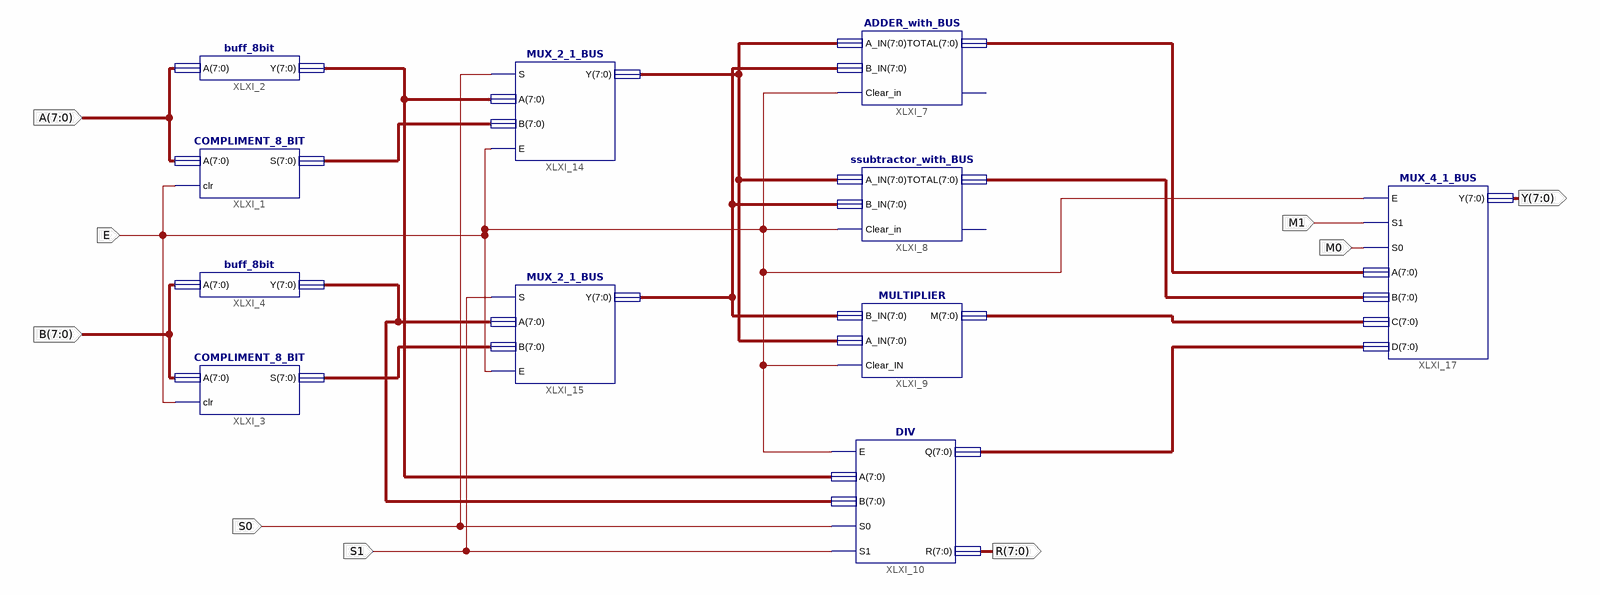
[diagram p0: schematic sheet 1]
// Xilinx ISE schematic CAlCULATOR.sch (artix7) as structural Verilog: 11 symbols, 9 ports
module CAlCULATOR (
  input  [7:0] A,
  input  [7:0] B,
  input  E,
  input  S0,
  input  S1,
  input  M1,
  input  M0,
  output [7:0] R,
  output [7:0] Y
);

  wire [7:0] XLXN_39, XLXN_40, XLXN_41, XLXN_42, XLXN_52, XLXN_54, XLXN_65, XLXN_66, XLXN_67, XLXN_68;

  COMPLIMENT_8_BIT XLXI_1 (.A(A), .clr(E), .S(XLXN_40));
  buff_8bit XLXI_2 (.A(A), .Y(XLXN_39));
  COMPLIMENT_8_BIT XLXI_3 (.A(B), .clr(E), .S(XLXN_42));
  buff_8bit XLXI_4 (.A(B), .Y(XLXN_41));
  ADDER_with_BUS XLXI_7 (.A_IN(XLXN_52), .B_IN(XLXN_54), .Clear_in(E), .TOTAL(XLXN_65));  // open: Cout
  ssubtractor_with_BUS XLXI_8 (.A_IN(XLXN_52), .B_IN(XLXN_54), .Clear_in(E), .TOTAL(XLXN_66));  // open: COUT_1
  MULTIPLIER XLXI_9 (.B_IN(XLXN_54), .A_IN(XLXN_52), .Clear_IN(E), .M(XLXN_67));
  DIV XLXI_10 (.E(E), .A(XLXN_39), .B(XLXN_41), .S0(S0), .S1(S1), .Q(XLXN_68), .R(R));
  MUX_2_1_BUS XLXI_14 (.S(S0), .A(XLXN_39), .B(XLXN_40), .E(E), .Y(XLXN_52));
  MUX_2_1_BUS XLXI_15 (.S(S1), .A(XLXN_41), .B(XLXN_42), .E(E), .Y(XLXN_54));
  MUX_4_1_BUS XLXI_17 (.E(E), .S1(M1), .S0(M0), .A(XLXN_65), .B(XLXN_66), .C(XLXN_67), .D(XLXN_68), .Y(Y));
endmodule
